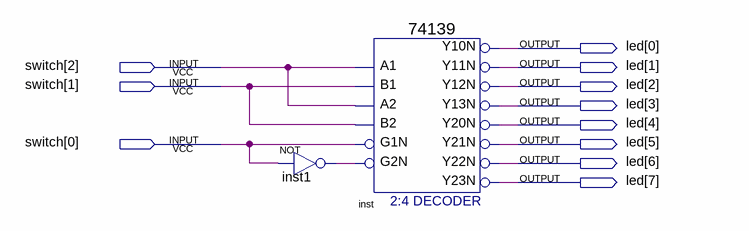
[diagram p0: schematic sheet]
// Quartus schematic pj402.bdf as structural Verilog: 2 symbols, 11 pins
module pj402 (
  input  [2:0] switch,
  output [7:0] led
);

  wire inst1_out;

  not inst1 (inst1_out, switch[0]);
  \74139  inst (
    .A1(switch[2]), .A2(switch[2]), .B1(switch[1]), .B2(switch[1]), .G1N(switch[0]), .G2N(inst1_out),
    .Y10N(led[0]), .Y20N(led[4]), .Y13N(led[3]), .Y12N(led[2]), .Y11N(led[1]), .Y21N(led[5]), .Y22N(led[6]),
    .Y23N(led[7]));
endmodule
